# EAGLE schematic SensorBoard (EAGLE 8.2.0)
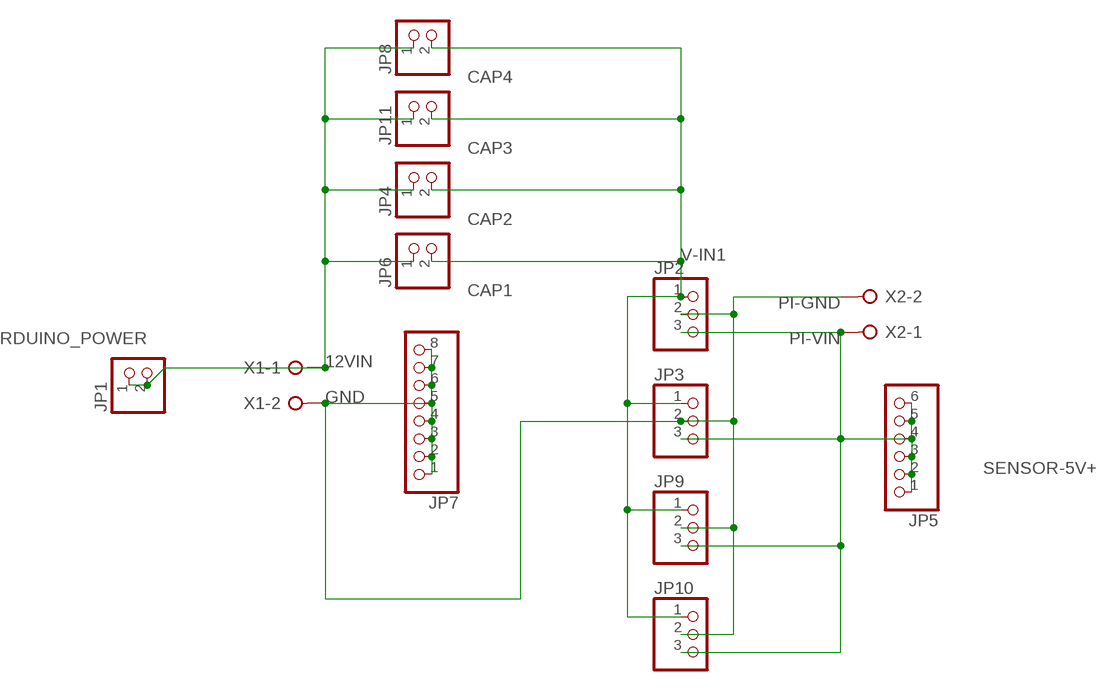
[diagram p0: schematic, sheet 1]

## Parts
JP1  PINHD-1X2  [1X02]
JP2  PINHD-1X3  [1X03]
JP3  PINHD-1X3  [1X03]
JP4  PINHD-1X2  [1X02]
JP5  PINHD-1X6  [1X06]
JP6  PINHD-1X2  [1X02]
JP7  PINHD-1X8  [1X08]
JP8  PINHD-1X2  [1X02]
JP9  PINHD-1X3  [1X03]
JP10  PINHD-1X3  [1X03]
JP11  PINHD-1X2  [1X02]
X1  W237-02P  [W237-132]
X2  W237-02P  [W237-132]

## Nets
COMMON-GND: JP2.2 JP3.2 JP7.1 JP7.2 JP7.3 JP7.4 JP7.5 JP7.6 JP7.7 JP7.8 JP9.2 JP10.2 X1.2 X2.2
N$1: JP1.1 JP1.2 JP4.1 JP6.1 JP8.1 JP11.1 X1.1
SENSOR-5V+: JP2.3 JP3.3 JP5.1 JP5.2 JP5.3 JP5.4 JP5.5 JP5.6 JP9.3 JP10.3 X2.1
V-IN1: JP2.1 JP3.1 JP4.2 JP6.2 JP8.2 JP9.1 JP10.1 JP11.2

## Library data of the parts
JP1 JP4 JP6 JP8 JP11 = pinhead:PINHD-1X2: PIN HEADER
JP2 JP3 JP9 JP10 = pinhead:PINHD-1X3: PIN HEADER
JP5 = pinhead:PINHD-1X6: PIN HEADER
JP7 = pinhead:PINHD-1X8: PIN HEADER
X1 X2 = con-wago-508:W237-02P: WAGO SREW CLAMP; OC_FARNELL: unknown; OC_NEWARK: unknown